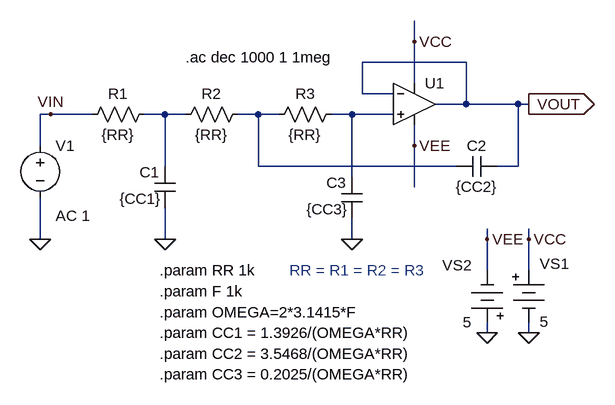
[diagram p0: schematic fig-02-07-12.asc]
fig-02-07-12.asc, the LTspice schematic file:
Version 4
SHEET 1 880 680
WIRE 192 64 192 32
WIRE 272 96 112 96
WIRE 192 128 192 64
WIRE 112 144 112 96
WIRE 160 144 112 144
WIRE 272 160 272 96
WIRE 272 160 224 160
WIRE 352 160 272 160
WIRE 368 160 352 160
WIRE -368 176 -384 176
WIRE -304 176 -368 176
WIRE -192 176 -224 176
WIRE -160 176 -192 176
WIRE -48 176 -80 176
WIRE -16 176 -48 176
WIRE 96 176 64 176
WIRE 160 176 96 176
WIRE -384 224 -384 176
WIRE 192 224 192 192
WIRE -192 256 -192 176
WIRE -48 256 -48 176
WIRE 256 256 -48 256
WIRE 352 256 352 160
WIRE 352 256 320 256
WIRE 96 272 96 176
WIRE 192 288 192 224
WIRE -384 368 -384 304
WIRE -192 368 -192 320
WIRE 96 368 96 336
WIRE 304 368 304 352
WIRE 368 368 368 352
WIRE 304 416 304 368
WIRE 368 416 368 368
WIRE 304 512 304 496
WIRE 368 512 368 496
FLAG 96 368 0
FLAG -384 368 0
FLAG 368 160 VOUT
IOPIN 368 160 Out
FLAG -368 176 VIN
FLAG 304 512 0
FLAG 368 512 0
FLAG 304 368 VEE
FLAG 368 368 VCC
FLAG 192 64 VCC
FLAG 192 224 VEE
FLAG -192 368 0
SYMBOL cap 80 272 R0
WINDOW 0 -23 9 Left 2
WINDOW 3 -54 50 Left 2
SYMATTR InstName C3
SYMATTR Value {CC3}
SYMBOL cap 320 240 R90
WINDOW 0 0 32 VBottom 2
WINDOW 3 32 32 VTop 2
SYMATTR InstName C2
SYMATTR Value {CC2}
SYMBOL res 80 160 R90
WINDOW 0 0 56 VBottom 2
WINDOW 3 32 56 VTop 2
SYMATTR InstName R3
SYMATTR Value {RR}
SYMBOL res -64 160 R90
WINDOW 0 0 56 VBottom 2
WINDOW 3 32 56 VTop 2
SYMATTR InstName R2
SYMATTR Value {RR}
SYMBOL voltage -384 208 R0
WINDOW 123 24 124 Left 2
WINDOW 39 0 0 Left 2
SYMATTR Value2 AC 1
SYMATTR InstName V1
SYMATTR Value ""
SYMBOL Misc\\battery 368 400 R0
WINDOW 0 17 6 Left 2
WINDOW 3 17 95 Left 2
WINDOW 123 0 0 Left 0
WINDOW 39 0 0 Left 0
SYMATTR InstName VS1
SYMATTR Value 5
SYMBOL Misc\\battery 304 512 R180
WINDOW 0 24 104 Left 2
WINDOW 3 24 16 Left 2
WINDOW 123 0 0 Left 0
WINDOW 39 0 0 Left 0
SYMATTR InstName VS2
SYMATTR Value 5
SYMBOL Opamps\\UniversalOpamp2 192 160 R0
SYMATTR InstName U1
SYMATTR Value2 Avol=10Meg GBW=100Meg Slew=10Meg
SYMBOL cap -208 256 R0
WINDOW 0 -23 9 Left 2
WINDOW 3 -54 50 Left 2
SYMATTR InstName C1
SYMATTR Value {CC1}
SYMBOL res -208 160 R90
WINDOW 0 0 56 VBottom 2
WINDOW 3 32 56 VTop 2
SYMATTR InstName R1
SYMATTR Value {RR}
TEXT -160 88 Left 2 !.ac dec 1000 1 1meg
TEXT 0 416 Left 2 ;RR = R1 = R2 = R3
TEXT -200 416 Left 2 !.param RR 1k
TEXT -200 480 Left 2 !.param OMEGA=2*3.1415*F
TEXT -200 512 Left 2 !.param CC1 = 1.3926/(OMEGA*RR)
TEXT -200 544 Left 2 !.param CC2 = 3.5468/(OMEGA*RR)
TEXT -200 448 Left 2 !.param F 1k
TEXT -200 576 Left 2 !.param CC3 = 0.2025/(OMEGA*RR)

The netlist it stands for:
* fig-02-07-12.asc
C3 N003 0 {CC3}
C2 VOUT N002 {CC2}
R3 N003 N002 {RR}
R2 N002 N001 {RR}
V1 VIN 0 AC 1
VS1 VCC 0 5
VS2 0 VEE 5
XU1 N003 VOUT VCC VEE VOUT level.2 Avol=10Meg GBW=100Meg Slew=10Meg ilimit=25m rail=0 Vos=0 phimargin=45 en=0 enk=0 in=0 ink=0 Rin=500Meg  ; pins IN+ IN- V+ V- OUT
C1 N001 0 {CC1}
R1 N001 VIN {RR}
.ac dec 1000 1 1meg
* RR = R1 = R2 = R3
.param RR 1k
.param OMEGA=2*3.1415*F
.param CC1 = 1.3926/(OMEGA*RR)
.param CC2 = 3.5468/(OMEGA*RR)
.param F 1k
.param CC3 = 0.2025/(OMEGA*RR)
.lib UniversalOpamps2.sub
.backanno
.end